# Altium schematic sheet mcu.SchDoc
size A4
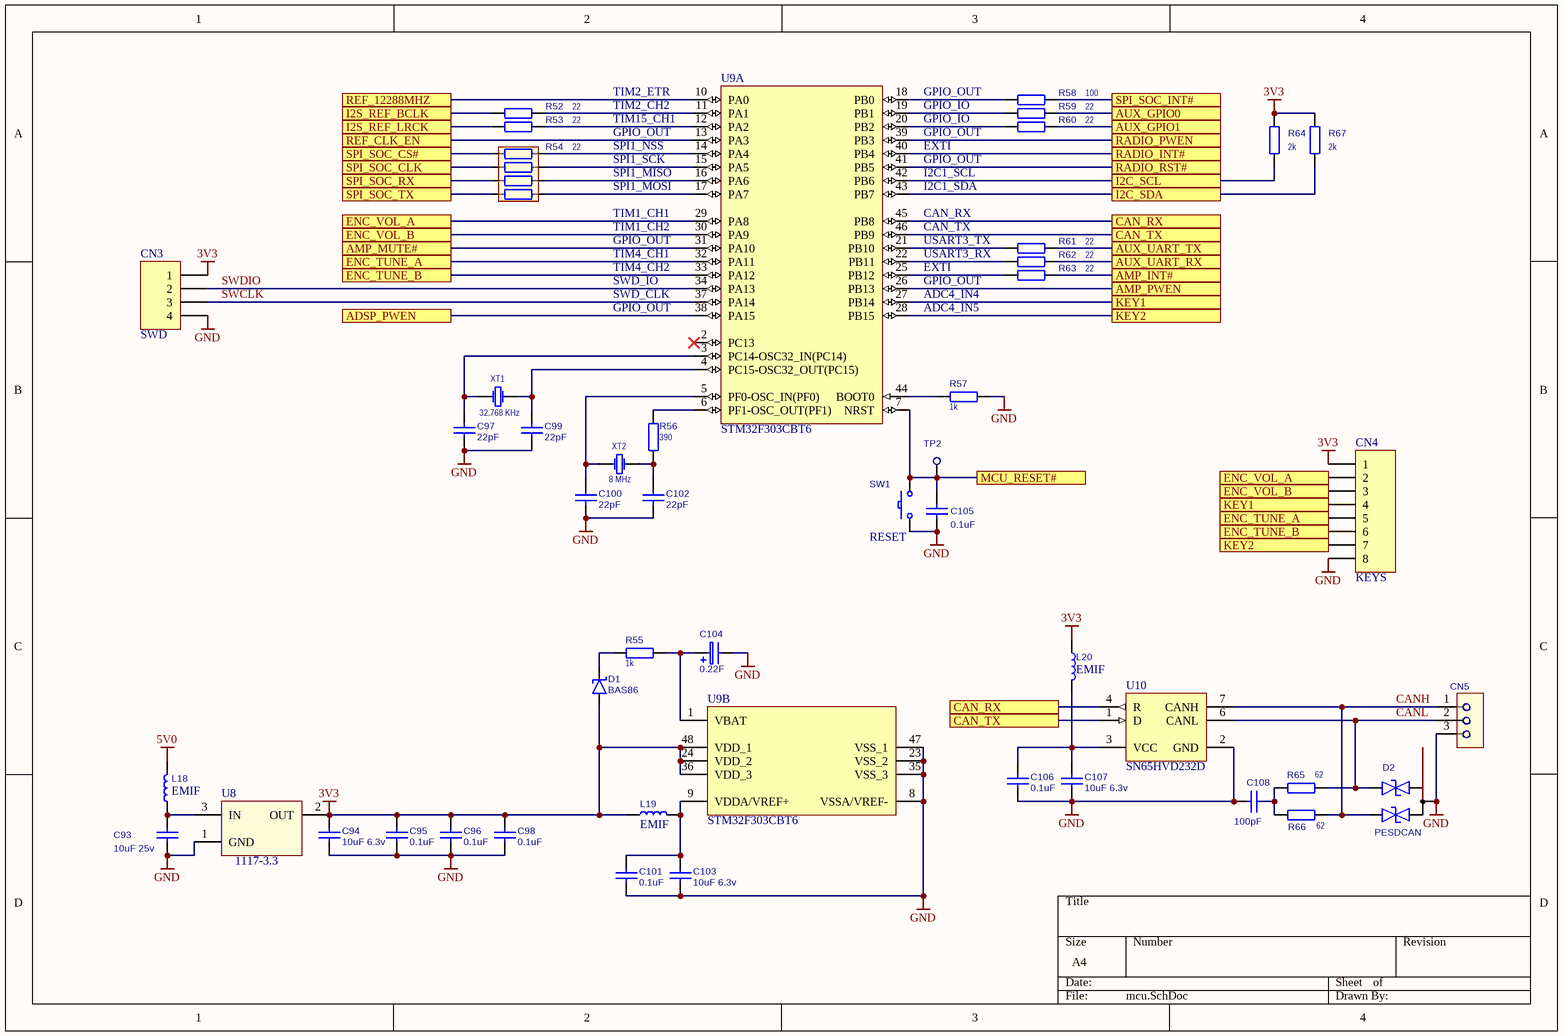
[diagram p0: mcu.SchDoc]

## Parts
C93  value 10uF 25v  [C0805]  (hidden comment: GRM21BR61E106KA73L)
C94  value 10uF 6.3v  [C0603]  (hidden comment: CC0603MRX5R5BB106)
C95  value 0.1uF  [C0603]  (hidden comment: CC0603KRX7R9BB104)
C96  value 0.1uF  [C0603]  (hidden comment: CC0603KRX7R9BB104)
C97  value 22pF  [C0603]  (hidden comment: CL10C220JB8NNNC)
C98  value 0.1uF  [C0603]  (hidden comment: CC0603KRX7R9BB104)
C99  value 22pF  [C0603]  (hidden comment: CL10C220JB8NNNC)
C100  value 22pF  [C0603]  (hidden comment: CL10C220JB8NNNC)
C101  value 0.1uF  [C0603]  (hidden comment: CC0603KRX7R9BB104)
C102  value 22pF  [C0603]  (hidden comment: CL10C220JB8NNNC)
C103  value 10uF 6.3v  [C0603]  (hidden comment: CC0603MRX5R5BB106)
C104  value 0.22F  [DS/DSK]  (hidden comment: CAP_POL)
C105  value 0.1uF  [C0603]  (hidden comment: C1608X7R1H104K080AA)
C106  value 0.1uF  [C0603]  (hidden comment: CC0603KRX7R9BB104)
C107  value 10uF 6.3v  [C0603]  (hidden comment: CC0603MRX5R5BB106)
C108  value 100pF  [C0603]  (hidden comment: CC0603JRNPO9BN101)
CN3  SWD  [PLS-4]
CN4  KEYS  [1.25-8AW]
CN5  DGxxx-3  [DG308-2.54-3P]  (value not drawn)
D1  value BAS86  [SOD-80C]  (hidden comment: SHOTTKY)
D2  value PESDCAN  [SOT-23-3]  (hidden comment: PESD)
L18  value EMIF  [IND0603]  (hidden comment: BLM18AG102SN1D)
L19  value EMIF  [IND0603]  (hidden comment: BLM18AG102SN1D)
L20  value EMIF  [IND0603]  (hidden comment: BLM18AG102SN1D)
R52  22  [R0603]
R53  22  [R0603]
R54  value 22  [R0804X4]  (hidden comment: TC124-JR-0722RL)
R55  1k  [R0603]
R56  390  [R0603]
R57  value 1k  [R0603]  (hidden comment: 0)
R58  100  [R0603]
R59  22  [R0603]
R60  22  [R0603]
R61  22  [R0603]
R62  22  [R0603]
R63  22  [R0603]
R64  2k  [R0603]
R65  62  [R0603]
R66  62  [R0603]
R67  2k  [R0603]
SW1  RESET  [TACTM-34N-F]
TP2  TEST-POINT  [PAD]  (value not drawn)
U8  value 1117-3.3  [SOT-223]  (hidden comment: 1117-xxx)
U9  STM32F303CBT6  [STM-LQFP48_N]  (parts A,B of 2)
U10  value SN65HVD232D  [D008_N]  (hidden comment: SN65HVD232)
XT1  value 32.768 KHz  [DT38]  (hidden comment: XTAL)
XT2  value 8 MHz  [HC-49/S-SMD]  (hidden comment: XTAL)

## Ports
ADSP_PWEN, AMP_INT#, AMP_MUTE#, AMP_PWEN, AUX_GPIO0, AUX_GPIO1, AUX_UART_RX, AUX_UART_TX, CAN_RX, CAN_TX, ENC_TUNE_A, ENC_TUNE_B, ENC_VOL_A, ENC_VOL_B, I2C_SCL, I2C_SDA, I2S_REF_BCLK, I2S_REF_LRCK, KEY1, KEY2, MCU_RESET#, RADIO_INT#, RADIO_PWEN, RADIO_RST#, REF_12288MHZ, REF_CLK_EN, SPI_SOC_CLK, SPI_SOC_CS#, SPI_SOC_INT#, SPI_SOC_RX, SPI_SOC_TX

## Nets
3V3: C94.2 C95.1 C96.1 C98.1 CN3.1 CN4.1 D1.1(A) L19.2 L20.2 R64.2 R67.2 U8.2(OUT) U9.24(VDD_2) U9.36(VDD_3) U9.48(VDD_1)
5V0: L18.1
GND: C93.1 C94.1 C95.2 C96.2 C97.2 C98.2 C99.2 C100.2 C101.2 C102.2 C103.2 C104.2(-) C105.2 C106.2 C107.2 C108.1 CN3.4 CN4.8 CN5.3 D2.3(C) R57.2 SW1.1 U8.1(GND) U9.8(VSSA/VREF-) U9.23(VSS_2) U9.35(VSS_3) U9.47(VSS_1) U10.2(GND)
ADSP_PWEN: U9.38(PA15) ; port ADSP_PWEN
AMP_INT#: R63.1 ; port AMP_INT#
AMP_MUTE#: U9.31(PA10) ; port AMP_MUTE#
AMP_PWEN: U9.26(PB13) ; port AMP_PWEN
AUX_GPIO0: R59.1 ; port AUX_GPIO0
AUX_GPIO1: R60.1 ; port AUX_GPIO1
AUX_UART_RX: R62.1 ; port AUX_UART_RX
AUX_UART_TX: R61.1 ; port AUX_UART_TX
CAN_RX: U9.45(PB8) U10.4(R) ; port CAN_RX
CAN_TX: U9.46(PB9) U10.1(D) ; port CAN_TX
CANH: CN5.1 D2.1(A) R66.1 U10.7(CANH)
CANL: CN5.2 D2.2(B) R65.1 U10.6(CANL)
ENC_TUNE_A: CN4.5 U9.32(PA11) ; port ENC_TUNE_A
ENC_TUNE_B: CN4.6 U9.33(PA12) ; port ENC_TUNE_B
ENC_VOL_A: CN4.2 U9.29(PA8) ; port ENC_VOL_A
ENC_VOL_B: CN4.3 U9.30(PA9) ; port ENC_VOL_B
I2C_SCL: R64.1 U9.42(PB6) ; port I2C_SCL
I2C_SDA: R67.1 U9.43(PB7) ; port I2C_SDA
I2S_REF_BCLK: R52.2 ; port I2S_REF_BCLK
I2S_REF_LRCK: R53.2 ; port I2S_REF_LRCK
KEY1: CN4.4 U9.27(PB14) ; port KEY1
KEY2: CN4.7 U9.28(PB15) ; port KEY2
MCU_RESET#: C105.1 SW1.2 TP2.1 U9.7(NRST) ; port MCU_RESET#
RADIO_INT#: U9.40(PB4) ; port RADIO_INT#
RADIO_PWEN: U9.39(PB3) ; port RADIO_PWEN
RADIO_RST#: U9.41(PB5) ; port RADIO_RST#
REF_12288MHZ: U9.10(PA0) ; port REF_12288MHZ
REF_CLK_EN: U9.13(PA3) ; port REF_CLK_EN
SPI_SOC_CLK: R54.6 ; port SPI_SOC_CLK
SPI_SOC_CS#: R54.8 ; port SPI_SOC_CS#
SPI_SOC_INT#: R58.1 ; port SPI_SOC_INT#
SPI_SOC_RX: R54.4 ; port SPI_SOC_RX
SPI_SOC_TX: R54.2 ; port SPI_SOC_TX
SWCLK: CN3.3 U9.37(PA14)
SWDIO: CN3.2 U9.34(PA13)
NetC93_2: C93.2 L18.2 U8.3(IN)
NetC97_1: C97.1 U9.3(PC14-OSC32_IN(PC14)) XT1.1
NetC99_1: C99.1 U9.4(PC15-OSC32_OUT(PC15)) XT1.2
NetC100_1: C100.1 U9.5(PF0-OSC_IN(PF0)) XT2.1
NetC101_1: C101.1 C103.1 L19.1 U9.9(VDDA/VREF+)
NetC102_1: C102.1 R56.2 XT2.2
NetC104_1: C104.1(+) R55.1 U9.1(VBAT)
NetC106_1: C106.1 C107.1 L20.1 U10.3(VCC)
NetC108_2: C108.2 R65.2 R66.2
NetD1_2: D1.2(K) R55.2
NetR52_1: R52.1 U9.11(PA1)
NetR53_1: R53.1 U9.12(PA2)
NetR54_1: R54.1 U9.17(PA7)
NetR54_3: R54.3 U9.16(PA6)
NetR54_5: R54.5 U9.15(PA5)
NetR54_7: R54.7 U9.14(PA4)
NetR56_1: R56.1 U9.6(PF1-OSC_OUT(PF1))
NetR57_1: R57.1 U9.44(BOOT0)
NetR58_2: R58.2 U9.18(PB0)
NetR59_2: R59.2 U9.19(PB1)
NetR60_2: R60.2 U9.20(PB2)
NetR61_2: R61.2 U9.21(PB10)
NetR62_2: R62.2 U9.22(PB11)
NetR63_2: R63.2 U9.25(PB12)

Not connected (* = marked no-connect by the designer): U9 2(PC13)*

## Notes on the sheet
- TIM2_ETR
- TIM2_CH2
- GPIO_IO
- GPIO_OUT
- TIM15_CH1
- SPI1_NSS
- SPI1_SCK
- SPI1_MISO
- I2C1_SCL
- (near U9) EXTI
- TIM1_CH1
- TIM1_CH2
- SPI1_MOSI
- (near U9) I2C1_SDA
- CAN_RX
- CAN_TX
- USART3_TX
- TIM4_CH1
- TIM4_CH2
- SWD_IO
- SWD_CLK
- ADC4_IN4
- ADC4_IN5
- USART3_RX

## Library data of the parts
C93-C103 C105-C108 = CAP_NPOL
CN3 = HDR 4: Header, 4-Pin; LatestRevisionDate: 17-Jul-2002; LatestRevisionNote: Re-released for DXP Platform.; Publisher: Altium Limited
CN4 = HDR 8: Header, 8-Pin; LatestRevisionDate: 17-Jul-2002; LatestRevisionNote: Re-released for DXP Platform.; Publisher: Altium Limited
CN5 = DGxxx-3: PCB terminal block; Value: *
D2 = TVS_BIDIR_DUAL: TVS Diodes
L18-L20 = IND_WO_IRON
R52 R53 R55-R67 = RESISTOR: RES
  R52 R53 R59-R63: Value: 22
  R55: Value: 1k
  R56: Value: 390
  R58: Value: 100
  R64 R67: Value: 2k
  R65 R66: Value: 62
R54 = ARRAY
SW1 = SW tact 2-pin: Microswitches, DTSMB-3 series; Value: SW tact 2-pin
TP2 = TEST-POINT: PCB terminal block; Value: *
U8 = LM1117
U9 = STM32F303CBT6: ARM Cortex-M4 32-bit MCU, 128 KB Flash, 32 KB Internal RAM, 37 I/Os, 48-pin LQFP, -40 to 85 degC, Tray; D/A Converter: 2x12-bit (2 Channel); FLASH Size (Prog) (kB): 128; I/Os (High Current): 37; Internal RAM Size (kB): 32; Operating Frequency(F) (Processor speed) (MHz): 72; Supply Voltage(Vcc) min (V): 2; DatasheetVersion: Rev. 6; PackageVersion: Rev. 6, 06/2013; PackageReference: LQFP48; PackageDescription: 48-Pin Low Profile Quad Flat Package, 7 x 7 mm Body, 0.5 mm Pitch; Supplier 1: Digi-Key; Supplier Part Number 1: STM32F303CBT6-ND; Supplier 2: Newark; Supplier Part Number 2: 99W9871; Supplier 3: Newark; Supplier Part Number 3: 66W7285; Core: ARM Cortex-M4; Packing: Tray; Mounting Technology: Surface Mount; PartNumber: STM32F303CBT6; ComponentLink1Description: Manufacturer URL; ComponentLink1URL: http://www.st.com/web/en/home.html; ComponentLink2Description: Datasheet; ComponentLink2URL: http://www.st.com/st-web-ui/static/active/en/resource/technical/document/datasheet/DM00058181.pdf; ComponentLink3Description: Package Specification; ComponentLink3URL: http://www.st.com/st-web-ui/static/active/en/resource/technical/document/datasheet/DM00058181.pdf